# EAGLE schematic Displayboard (EAGLE 6.4)
Displayboard
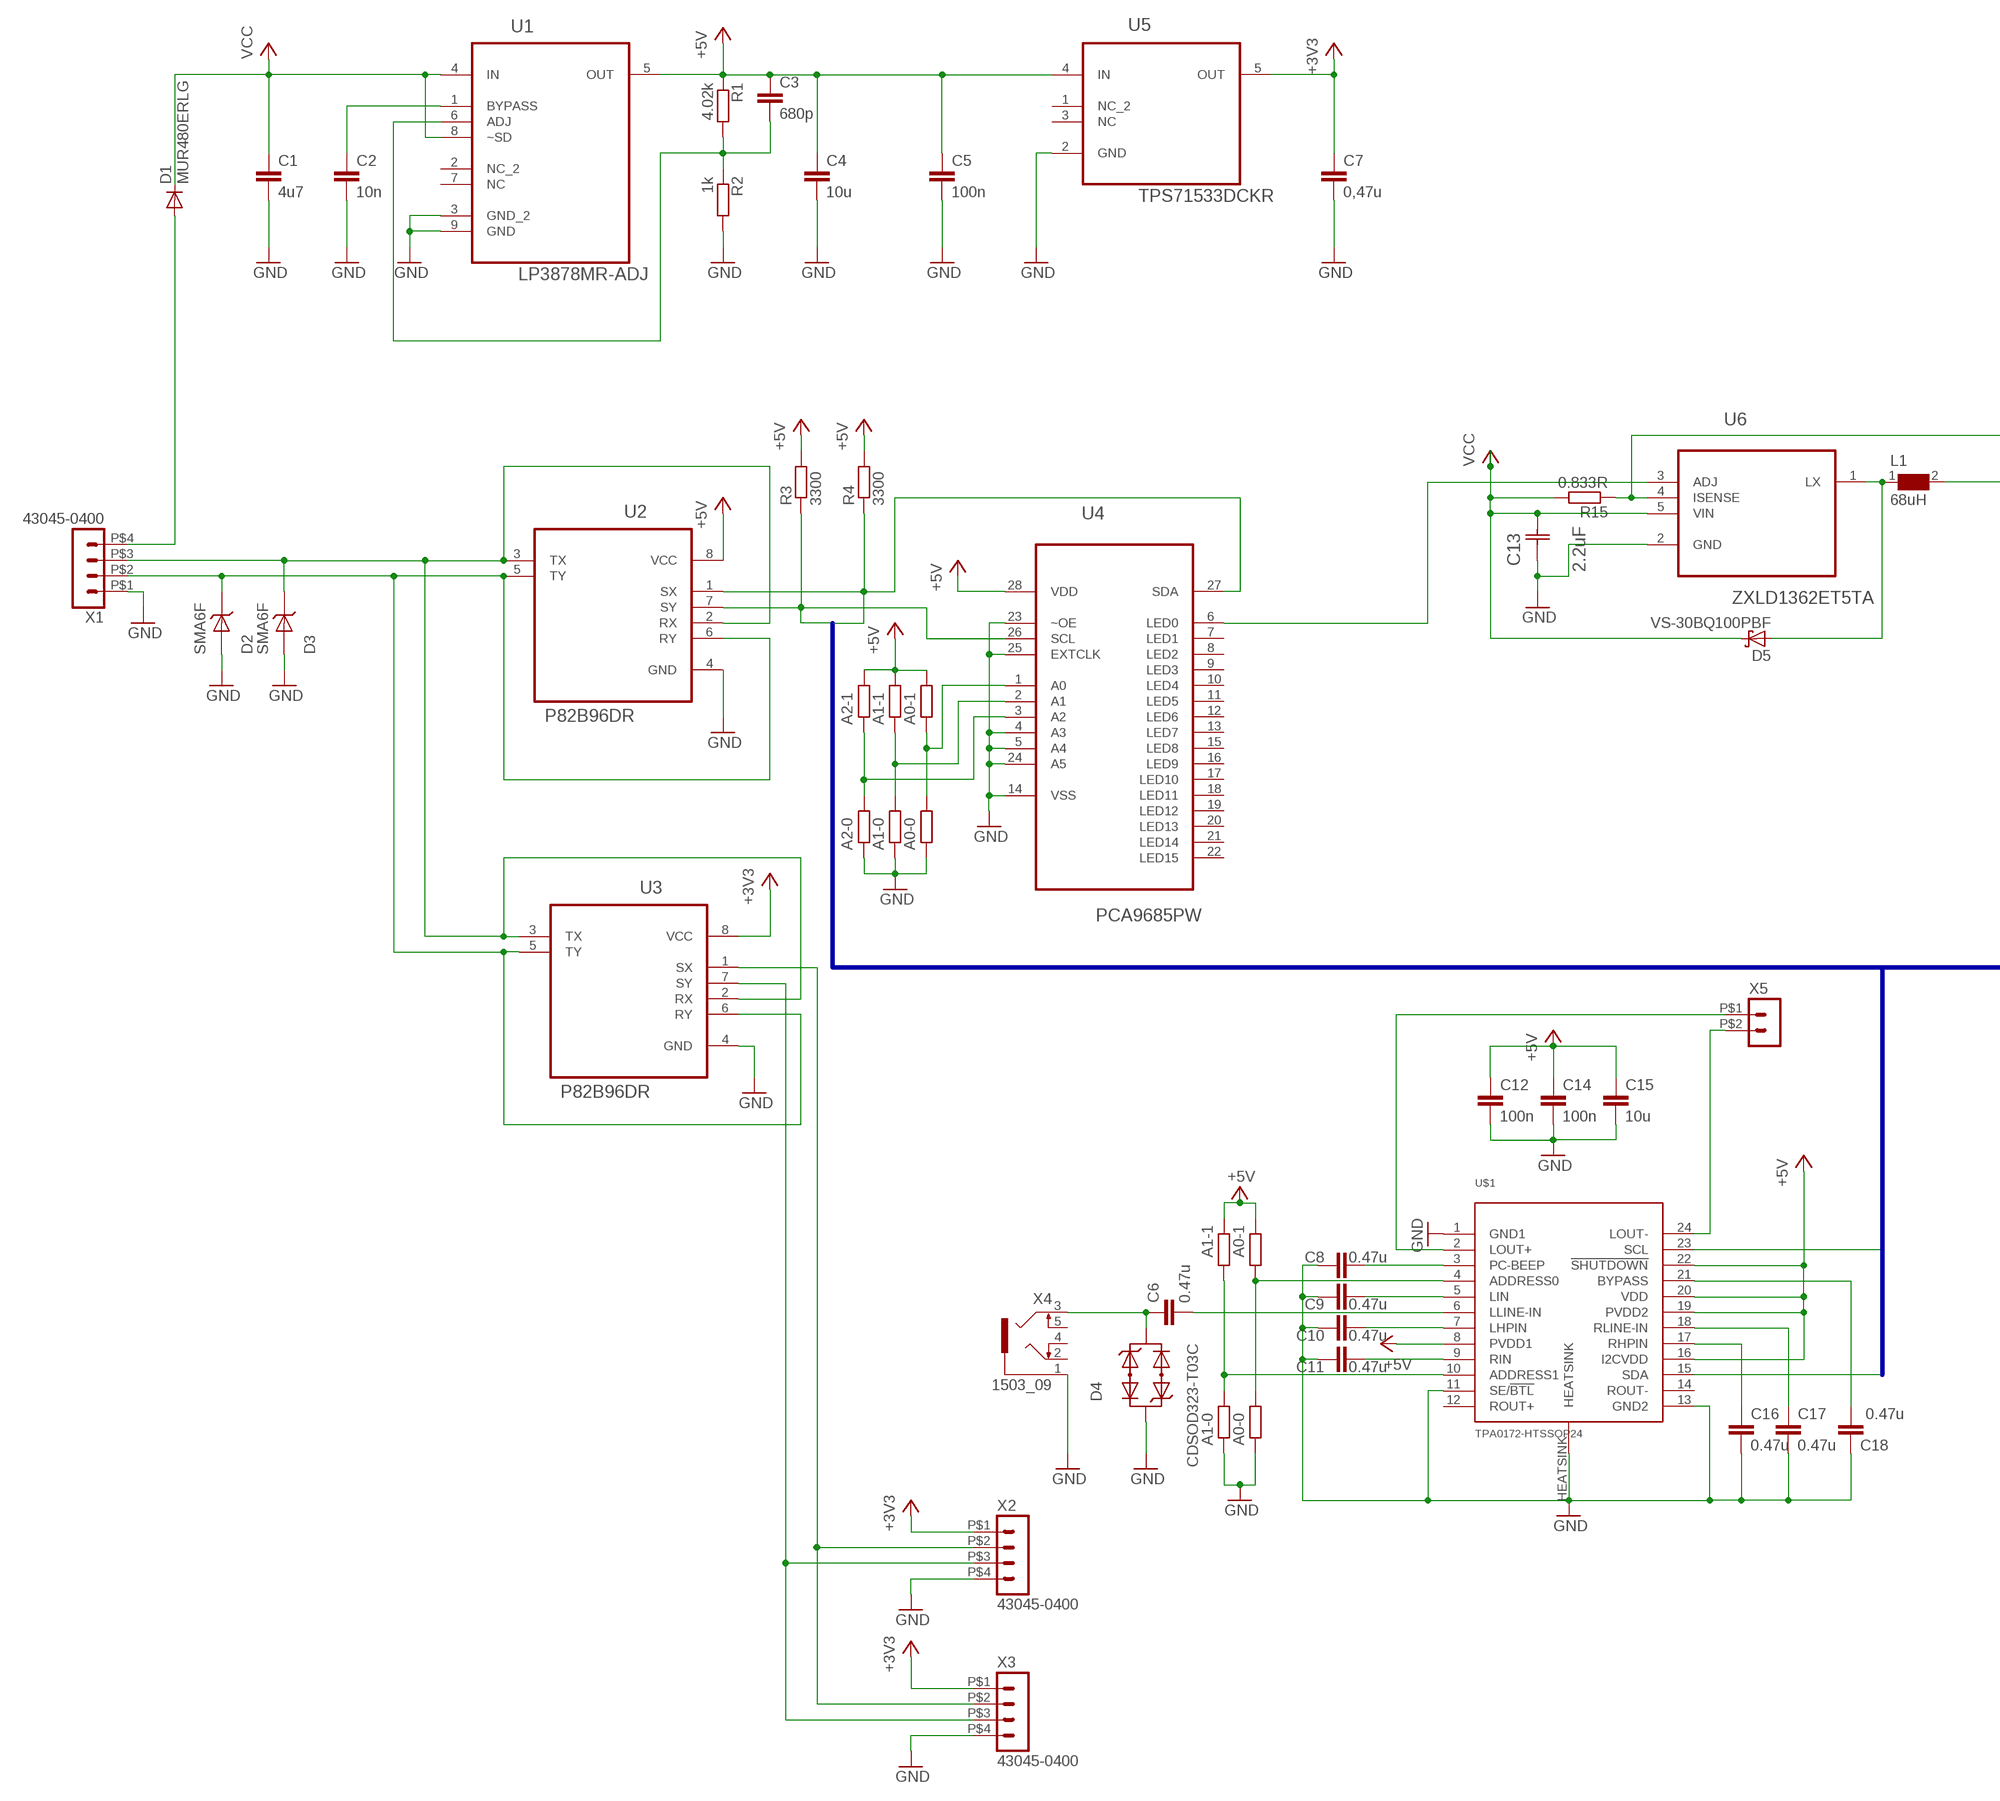
[diagram p0: schematic, sheet 1, part 1 of 2]
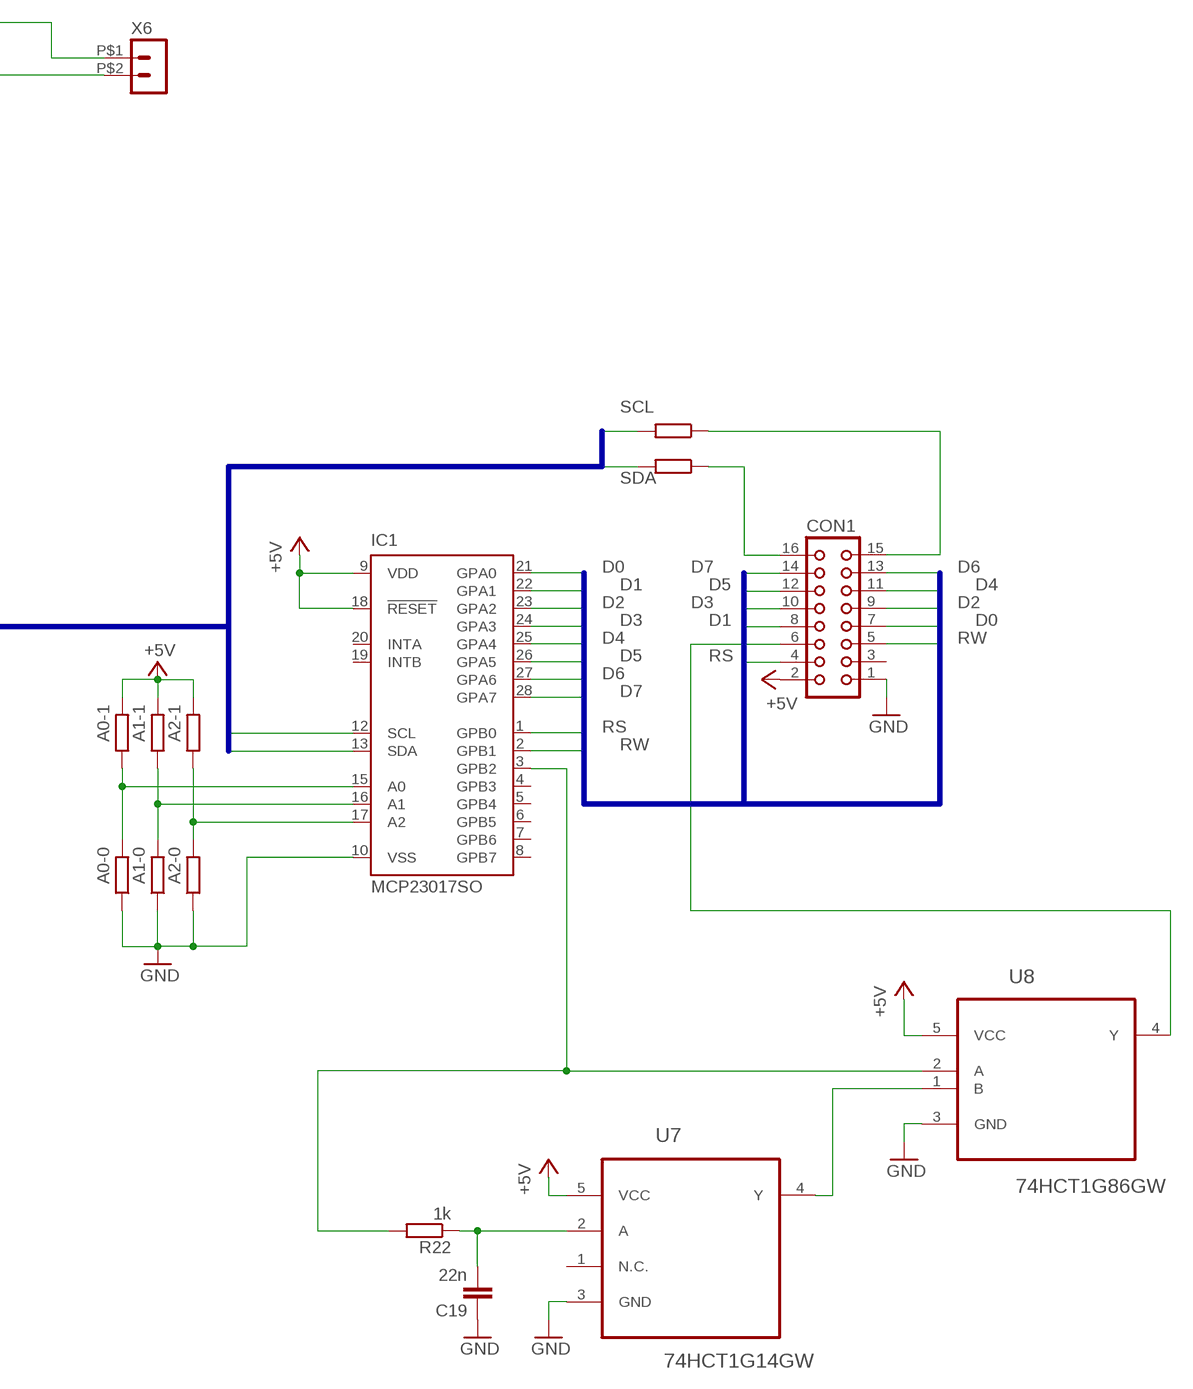
[diagram p1: schematic, sheet 1, part 2 of 2]

## Parts
C1  4u7  C-EUC1206  [C1206]
C2  10n  C-EUC1608  [C1608]
C3  680p  C-EUC1608  [C1608]
C4  10u  C-EUC2012  [C2012]
C5  100n  C-EUC0805  [C0805]
C6  0.47u  C-EUC0805  [C0805]
C7  0,47u  C-EUC1206  [C1206]
C8  0.47u  C-EUC0805  [C0805]
C9  0.47u  C-EUC0805  [C0805]
C10  0.47u  C-EUC0805  [C0805]
C11  0.47u  C-EUC0805  [C0805]
C12  100n  C-EUC0805  [C0805]
C13  2.2uF  08053C225KAT2A  [CAPC2013X152N]
C14  100n  C-EUC0805  [C0805]
C15  10u  C-EUC2012  [C2012]
C16  0.47u  C-EUC0805  [C0805]
C17  0.47u  C-EUC0805  [C0805]
C18  0.47u  C-EUC0805  [C0805]
C19  22n  C-EUC0805  [C0805]
CON1  CON16  [CON16]
D1  MUR480ERLG  MUR150RL  [DO41-10]
D2  SMA6F  [DO-221AC]
D3  SMA6F  [DO-221AC]
D4  CDSOD323-T03C  [SOD323]
D5  VS-30BQ100PBF  [DO-214AB]
IC1  MCP23017SO  [SO28W]
L1  68uH  WE-PD4-74456168_L  [L]
R1  4.02k  R-EU_R0603  [R0603]
R2  1k  R-EU_R0603  [R0603]
R3  3300  R-EU_0204/7  [0204/7]
R4  3300  R-EU_0204/7  [0204/7]
R5  A2-1  R-EU_R0402  [R0402]
R6  A2-0  R-EU_R0402  [R0402]
R7  A1-1  R-EU_R0402  [R0402]
R8  A1-0  R-EU_R0402  [R0402]
R9  A0-1  R-EU_R0402  [R0402]
R10  A0-0  R-EU_R0402  [R0402]
R11  A1-1  R-EU_R0402  [R0402]
R12  A1-0  R-EU_R0402  [R0402]
R13  A0-1  R-EU_R0402  [R0402]
R14  A0-0  R-EU_R0402  [R0402]
R15  0.833R  R-EU_R0603  [R0603]
R16  A0-1  R-EU_R0402  [R0402]
R17  A0-0  R-EU_R0402  [R0402]
R18  A1-1  R-EU_R0402  [R0402]
R19  A1-0  R-EU_R0402  [R0402]
R20  A2-1  R-EU_R0402  [R0402]
R21  A2-0  R-EU_R0402  [R0402]
R22  1k  R-EU_0204/7  [0204/7]
R23  SCL  R-EU_R0402  [R0402]
R24  SDA  R-EU_R0402  [R0402]
U1  LP3878MR-ADJ  [SOIC127P600X168-8N]
U2  P82B96DR  [SOIC127P600X175-8N]
U3  P82B96DR  [SOIC127P600X175-8N]
U4  PCA9685PW  [SOP65P640X110-28N]
U5  TPS71533DCKR  [SOT65P210X110-5N]
U6  ZXLD1362ET5TA  [SOT95P270X145-5N]
U7  74HCT1G14GW  [SOT65P210X110-5N]
U8  74HCT1G86GW  [SOT65P210X110-5N]
U$1  TPA0172-HTSSOP24  [HT-TSSOP-24]
X1  43045-0400  HEADER_POS4_43045-0401  [43045-0400]
X2  43045-0400  HEADER_POS4_43045-0401  [43045-0400]
X3  43045-0400  HEADER_POS4_43045-0401  [43045-0400]
X4  1503_09  [1503_09]
X5  HEADER_POS2_43045-0200  [43045-0200]
X6  HEADER_POS2_43045-0200  [43045-0200]

## Nets
+3V3 [Normal Bcc]: C7.1 U3.8(VCC) U5.5(OUT) X2.P$1 X3.P$1
+5V [Normal Bcc]: C3.1 C4.1 C5.1 C12.1 C14.1 C15.1 CON1.2 IC1.9(VDD) IC1.18(!RESET) R1.1 R3.2 R4.2 R5.2 R7.2 R9.2 R11.2 R13.2 R16.2 R18.2 R20.2 U1.5(OUT) U2.8(VCC) U4.28(VDD) U5.4(IN) U7.5(VCC) U8.5(VCC) U$1.8(PVDD1) U$1.16(I2CVDD) U$1.19(PVDD2) U$1.20(VDD) U$1.22(!SHUTDOWN)
D0: CON1.7 IC1.21(GPA0)
D1: CON1.8 IC1.22(GPA1)
D2: CON1.9 IC1.23(GPA2)
D3: CON1.10 IC1.24(GPA3)
D4: CON1.11 IC1.25(GPA4)
D5: CON1.12 IC1.26(GPA5)
D6: CON1.13 IC1.27(GPA6)
D7: CON1.14 IC1.28(GPA7)
GND: C1.2 C2.2 C4.2 C5.2 C7.2 C8.1 C9.1 C10.1 C11.1 C12.2 C13.1(C1) C14.2 C15.2 C16.2 C17.2 C18.1 C19.1 CON1.1 D2.AN D3.AN D4.P$1 IC1.10(VSS) R2.2 R6.1 R8.1 R10.1 R12.1 R14.1 R17.1 R19.1 R21.1 U1.3(GND_2) U1.9(GND) U2.4(GND) U3.4(GND) U4.4(A3) U4.5(A4) U4.14(VSS) U4.23(~OE) U4.24(A5) U4.25(EXTCLK) U5.2(GND) U6.2(GND) U7.3(GND) U8.3(GND) U$1.1(GND1) U$1.11(SE/!BTL) U$1.13(GND2) U$1.HEATSINK X1.P$1 X2.P$4 X3.P$4 X4.1
N$1 [LED Current]: R15.1 U6.4(ISENSE) X6.P$1
N$2: D3.KAT U2.2(RX) U2.3(TX) U3.2(RX) U3.3(TX) X1.P$3
N$3: IC1.3(GPB2) R22.2 U8.2(A)
N$4: C16.1 U$1.17(RHPIN)
N$5: C17.1 U$1.18(RLINE-IN)
N$6 [LED Current]: L1.2 X6.P$2
N$7: U3.1(SX) X2.P$2 X3.P$2
N$8: U4.6(LED0) U6.3(ADJ)
N$9: U3.7(SY) X2.P$3 X3.P$3
N$10 [LED Current]: D5.A L1.1 U6.1(LX)
N$11: U$1.24(LOUT-) X5.P$2
N$12: U$1.2(LOUT+) X5.P$1
N$13: C6.2 U$1.6(LLINE-IN)
N$14: C11.2 U$1.9(RIN)
N$15: C10.2 U$1.7(LHPIN)
N$16: C9.2 U$1.5(LIN)
N$17: C8.2 U$1.3(PC-BEEP)
N$18: IC1.16(A1) R18.1 R19.2
N$19: IC1.15(A0) R16.1 R17.2
N$20: R5.1 R6.2 U4.3(A2)
N$21: IC1.17(A2) R20.1 R21.2
N$22: D2.KAT U2.5(TY) U2.6(RY) U3.5(TY) U3.6(RY) X1.P$2
N$23: C18.2 U$1.21(BYPASS)
N$24: C3.2 R1.2 R2.1 U1.6(ADJ)
N$25 [Big Vcc]: D1.A X1.P$4
N$26: C2.1 U1.1(BYPASS)
N$27: CON1.16 R24.1
N$28: CON1.15 R23.1
N$29: R7.1 R8.2 U4.2(A1)
N$30: C19.2 R22.1 U7.2(A)
N$31: U7.4(Y) U8.1(B)
N$32: CON1.6 U8.4(Y)
N$41: R13.1 R14.2 U$1.4(ADDRESS0)
N$42: R11.1 R12.2 U$1.10(ADDRESS1)
N$43: R9.1 R10.2 U4.1(A0)
N$49: C6.1 D4.P$2 X4.3
RS: CON1.4 IC1.1(GPB0)
RW: CON1.5 IC1.2(GPB1)
SCL: IC1.12(SCL) R3.1 R23.2 U2.7(SY) U4.26(SCL) U$1.23(SCL)
SDA: IC1.13(SDA) R4.1 R24.2 U2.1(SX) U4.27(SDA) U$1.15(SDA)
VCC [Big Vcc]: C1.1 C13.2(C2) D1.C D5.K(C) R15.2 U1.4(IN) U1.8(~SD) U6.5(VIN)
Unconnected: CON1.3 IC1.4(GPB3) IC1.5(GPB4) IC1.6(GPB5) IC1.7(GPB6) IC1.8(GPB7) IC1.19(INTB) IC1.20(INTA) U1.2(NC_2) U1.7(NC) U4.7(LED1) U4.8(LED2) U4.9(LED3) U4.10(LED4) U4.11(LED5) U4.12(LED6) U4.13(LED7) U4.15(LED8) U4.16(LED9) U4.17(LED10) U4.18(LED11) U4.19(LED12) U4.20(LED13) U4.21(LED14) U4.22(LED15) U5.1(NC_2) U5.3(NC) U7.1(N.C.) U$1.12(ROUT+) U$1.14(ROUT-) X4.2 X4.4 X4.5

## Buses
D[0..7],RS,RW
SDA,SCL

## Library data of the parts
C1-C12 C14-C19 = rcl:C-EU: CAPACITOR, European symbol
C13 = AVX_By_element14_Batch_1:08053C225KAT2A: Capacitor 0805; MPN: 08053C225KAT2A; OC_FARNELL: 1657931; OC_NEWARK: 10R5975; SUPPLIER: AVX; TOLERANCE: ±10%; VOLTAGERATING: 25V
CON1 = con-harting:CON16: CONNECTOR; OC_FARNELL: unknown; OC_NEWARK: unknown
D1 = diode:MUR150RL: DIODE
D2 D3 = MyComponents:SMA6F
D4 = MyComponents:CDSOD323-T03C
D5 = MyComponents:VS-30BQ100PBF
IC1 = microchip:MCP23017: http://ww1.microchip.com/downloads/en/DeviceDoc/21952a.pdf Source: http://ww1.microchip.com/downloads/en/DeviceDoc/21952a.pdf; MF: MICROCHIP; MPN: MCP23017-E/SO; OC_FARNELL: 1332087; OC_NEWARK: 31K2958
L1 = WE-PD4:WE-PD4: SMD-Power Inductors WE-PD4 - Current loading up to 35 A - Compact size - Low-loss ferrite core - High storage capacity - Industry standardized size - Application frequency range up to 10 MHz -- Is recommended for the application with switching regulators from National Semiconductor, Linear Technology, Texas Instruments and Fairchild Semiconductor -- Noise suppression -- Perfectly suitable for switching regulators with extremely high efficiency; MPN: 74456168; OC_FARNELL: 1636136; OC_NEWARK: 08P2689; PACKAGE: Type_L; SUPPLIER: Wuerth Elektronik
R1 R2 R5-R21 R23 R24 = resistor:R-EU_: RESISTOR, European symbol
R3 R4 R22 = rcl:R-EU_: RESISTOR, European symbol
U1 = Texas:LP3878MR-ADJ: Voltage Regulator; MPN: LP3878MR-ADJ; OC_FARNELL: 1286784; OC_NEWARK: 65K6513; PACKAGE: SOIC-8; SUPPLIER: NationalSemiconductor
U2 U3 = Texas:P82B96DR: DUAL BIDIRECTIONAL BUS BUFFER; MPN: P82B96DR; OC_FARNELL: 1576671; OC_NEWARK: 88K6385; PACKAGE: SOIC-8; SUPPLIER: Texas Instruments
U4 = NXP_By_element14_Batch_1:PCA9685PW: 16-channel, 12-bit PWM Fm+ I2C-bus LED controller; MPN: PCA9685PW; OC_FARNELL: 1854074; OC_NEWARK: 19T6398; PACKAGE: TSSOP-28; SUPPLIER: NXP
U5 = Texas:TPS71533DCKR: Linear Regulator; MPN: TPS71533DCKR; OC_FARNELL: 1135383; OC_NEWARK: 77C0815; PACKAGE: SC-70-5; SUPPLIER: Texas Instruments
U6 = ZEtex:ZXLD1362ET5TA: 60V 1A LED DRIVER WITH AEC-Q100; MPN: ZXLD1362ET5TA; OC_FARNELL: 1843876; OC_NEWARK: 12T2272; PACKAGE: SOT-5; SUPPLIER: DIODES INC.
U7 = NXP_By_element14_Batch_1:74HCT1G14GW: Inverting Schmitt trigger; MPN: 74HCT1G14GW; OC_FARNELL: 1085264; OC_NEWARK: 99K0543; PACKAGE: SOT-5; SUPPLIER: NXP
U8 = NXP_By_element14_Batch_1:74HCT1G86GW: 2-input EXCLUSIVE-OR gate; MPN: 74HCT1G86GW; OC_FARNELL: 1085266; OC_NEWARK: 99K0545; PACKAGE: SOT-5; SUPPLIER: NXP
U$1 = MyComponents:TPA0172-HTSSOP24
X1-X3 = con-molex-micro-fit-3_0:HEADER_POS4_?: Molex - Micro-Fit 3.0 Series connector, 3.00mm (0.118") pitch header, 4 positions.
X4 = con-lumberg:1503_09: Jack connectors according to JISC 6560, 3.5 mm Klinkeneinbaukupplung nach JISC 6560, 3,5 mm, 3-polig/ stereo, abgewinkelte Ausführung, mit 2 Öffnern und Lötaugen, für Leiterplatten Rückseitenmontage Source: http://www.lumberg.com/Produkte/PDFs/1503_09.pdf; OC_FARNELL: 1243244; OC_NEWARK: unknown
X5 X6 = con-molex-micro-fit-3_0:HEADER_POS2_?: Molex - Micro-Fit 3.0 Series connector, 3.00mm (0.118") pitch header, 2 positions.

## Net classes
0 default: width 0.254 mm, clearance 0.254 mm
1 Normal Bcc: width 0.254 mm, clearance 0.254 mm
2 Big Vcc: width 0.762 mm, clearance 0.254 mm
3 LED Current: width 0.381 mm, clearance 0.254 mm